# EAGLE schematic SLA_1500_CAM_V3 (EAGLE 9.2.1)
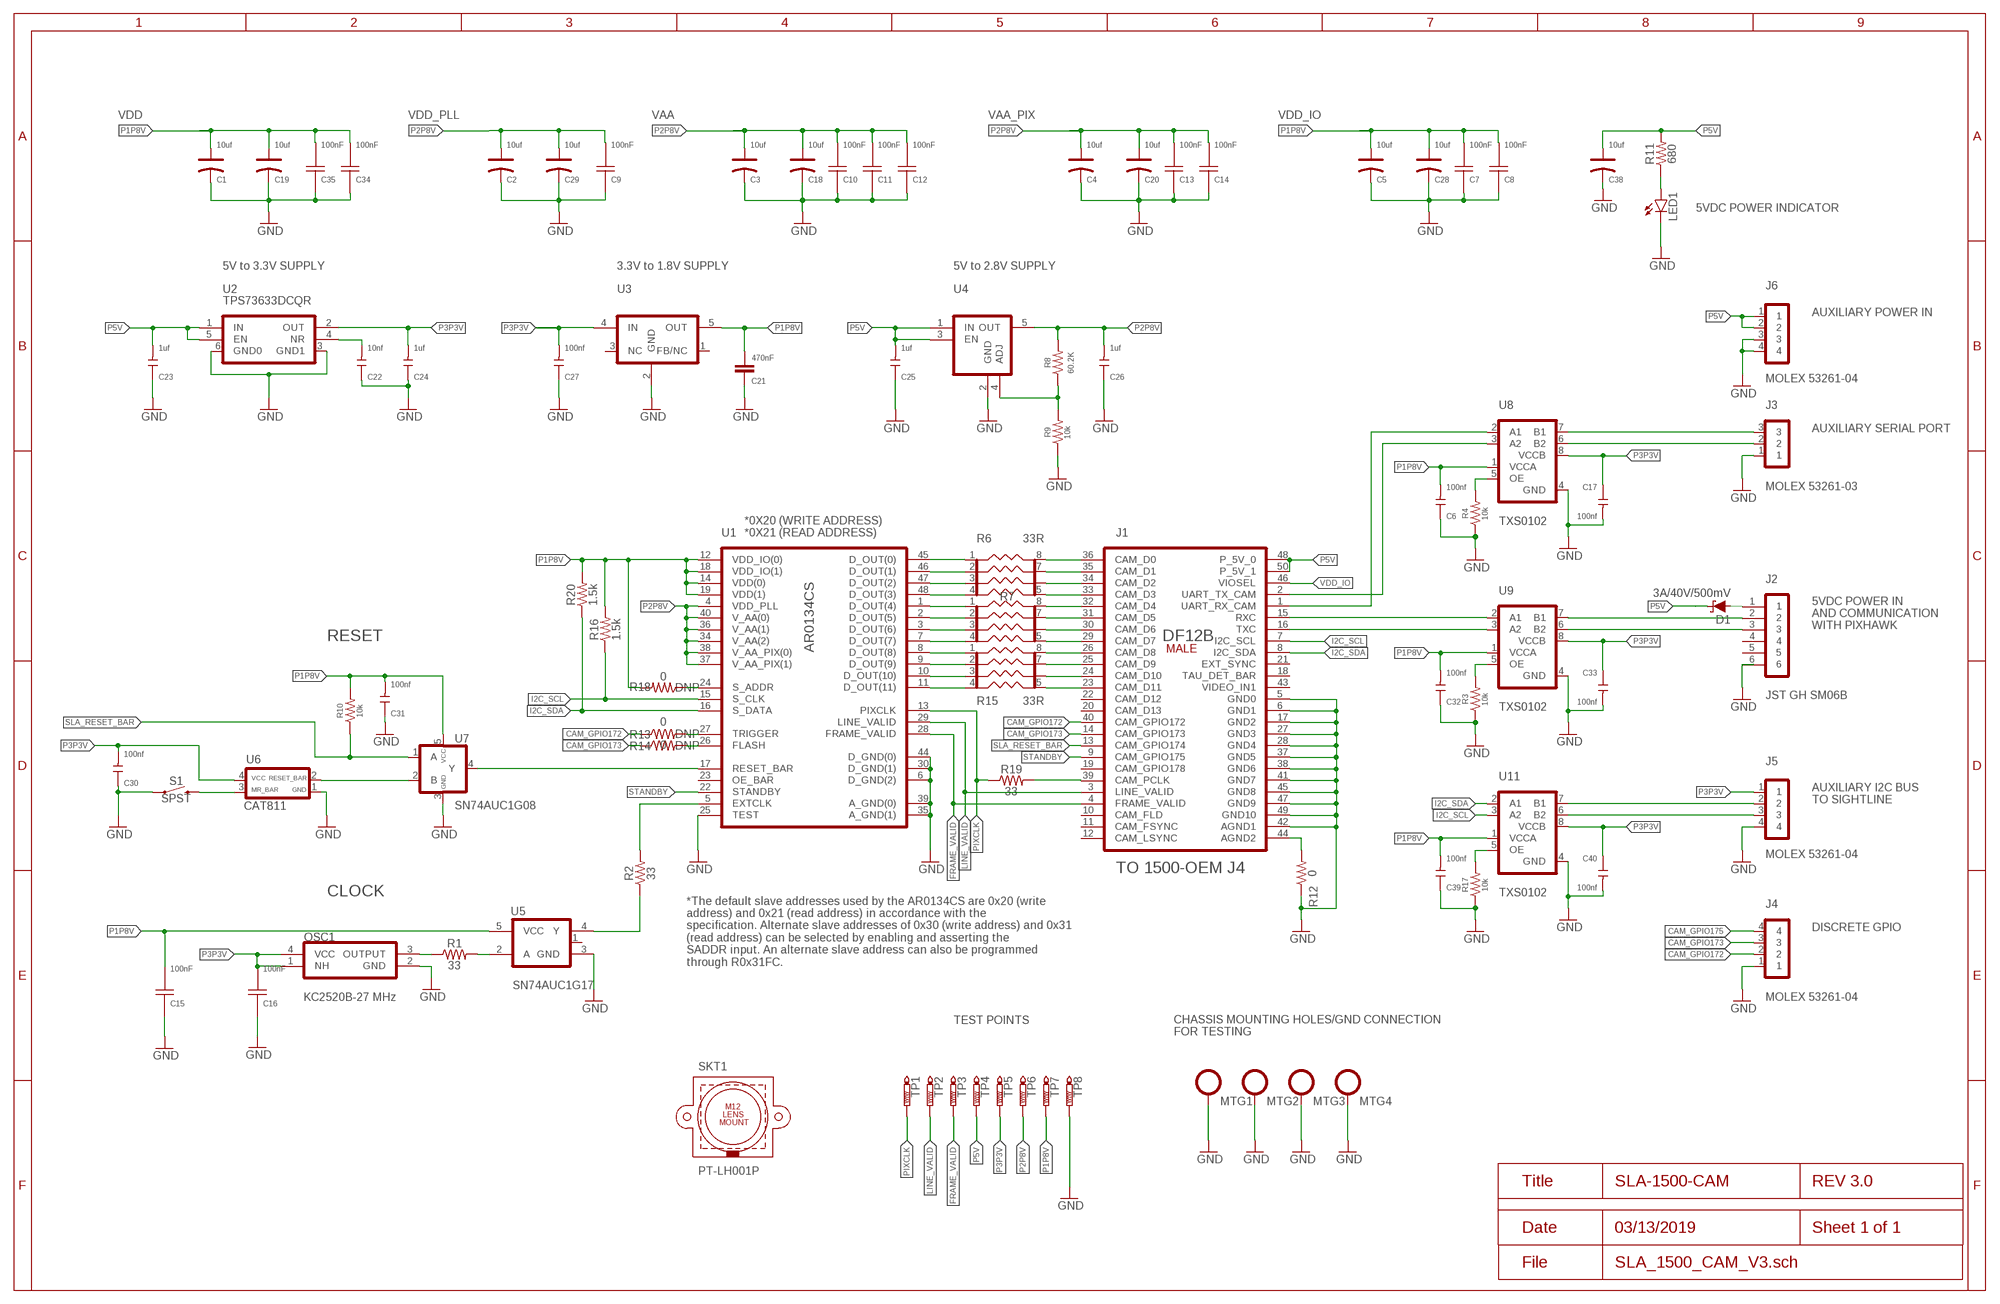
[diagram p0: schematic, sheet 1]
FRAME1 (FRAME_B_L): SPICEPREFIX: X

## Parts
C1  10uf  TANTALUM-SMD-10UF-10V-10%(AVX-A)  [AVX-A]
C2  10uf  TANTALUM-SMD-10UF-10V-10%(AVX-A)  [AVX-A]
C3  10uf  TANTALUM-SMD-10UF-10V-10%(AVX-A)  [AVX-A]
C4  10uf  TANTALUM-SMD-10UF-10V-10%(AVX-A)  [AVX-A]
C5  10uf  TANTALUM-SMD-10UF-10V-10%(AVX-A)  [AVX-A]
C6  100nf  CERAMIC-100NF-25V-10%-X7R(0402)  [C0402]
C7  CAP0201100NF  [R0201]
C8  CAP0201100NF  [R0201]
C9  CAP0201100NF  [R0201]
C10  CAP0201100NF  [R0201]
C11  CAP0201100NF  [R0201]
C12  CAP0201100NF  [R0201]
C13  CAP0201100NF  [R0201]
C14  CAP0201100NF  [R0201]
C15  CAP0201100NF  [R0201]
C16  CAP0201100NF  [R0201]
C17  100nf  CERAMIC-100NF-25V-10%-X7R(0402)  [C0402]
C18  10uf  TANTALUM-SMD-10UF-10V-10%(AVX-A)  [AVX-A]
C19  10uf  TANTALUM-SMD-10UF-10V-10%(AVX-A)  [AVX-A]
C20  10uf  TANTALUM-SMD-10UF-10V-10%(AVX-A)  [AVX-A]
C21  470nF  470NF-0402-16V-10%  [0402]
C22  10nf  CERAMIC-10NF-50V-10%-X7R(0402)  [C0402]
C23  1uf  CERAMIC-1UF-10V-10%-X5R(0402)  [C0402]
C24  1uf  CERAMIC-1UF-10V-10%-X5R(0402)  [C0402]
C25  1uf  CERAMIC-1UF-10V-10%-X5R(0402)  [C0402]
C26  1uf  CERAMIC-1UF-10V-10%-X5R(0402)  [C0402]
C27  100nf  CERAMIC-100NF-25V-10%-X7R(0402)  [C0402]
C28  10uf  TANTALUM-SMD-10UF-10V-10%(AVX-A)  [AVX-A]
C29  10uf  TANTALUM-SMD-10UF-10V-10%(AVX-A)  [AVX-A]
C30  100nf  CERAMIC-100NF-25V-10%-X7R(0402)  [C0402]
C31  100nf  CERAMIC-100NF-25V-10%-X7R(0402)  [C0402]
C32  100nf  CERAMIC-100NF-25V-10%-X7R(0402)  [C0402]
C33  100nf  CERAMIC-100NF-25V-10%-X7R(0402)  [C0402]
C34  CAP0201100NF  [R0201]
C35  CAP0201100NF  [R0201]
C38  10uf  TANTALUM-SMD-10UF-10V-10%(AVX-A)  [AVX-A]
C39  100nf  CERAMIC-100NF-25V-10%-X7R(0402)  [C0402]
C40  100nf  CERAMIC-100NF-25V-10%-X7R(0402)  [C0402]
D1  3A/40V/500mV  DIODE-SCHOTTKY-B340A  [SMA-DIODE]
J1  DF12B(5.0)-50DS-0.5(86)SMT  [DF12B(5.0)-50DS-0.5V(86)]
J2  JST GH SM06B  JST_GH_SM06B-GHS-TB  [JST_SM06B-GHS-TB]
J3  MOLEX 53261-03  MOLEX53261-03  [53261-03]
J4  MOLEX 53261-04  MOLEX53261-04  [53261-04]
J5  MOLEX 53261-04  MOLEX53261-04  [53261-04]
J6  MOLEX 53261-04  MOLEX53261-04  [53261-04]
LED1  LEDCHIP-LED0603  [CHIP-LED0603]
MTG1  SLA_MOUNTING  [SLA_MOUNTING]
MTG2  SLA_MOUNTING  [SLA_MOUNTING]
MTG3  SLA_MOUNTING  [SLA_MOUNTING]
MTG4  SLA_MOUNTING  [SLA_MOUNTING]
OSC1  KC2520B-27MHZ  [2.5X2.0_SMDCRYSTAL]
R1  33  RESISTOR0402  [0402]
R2  33  RESISTOR0402  [0402]
R3  10k  10KOHM-0603-1/10W-1%  [0603]
R4  10k  10KOHM-0603-1/10W-1%  [0603]
R6  33R  YC124-JR-0733RL  [DILR-4]
R7  YC124-JR-0733RL  [DILR-4]
R8  60.2K  62KOHM-0603-1/10W-5%  [0603]
R9  10k  10KOHM-0603-1/10W-1%  [0603]
R10  10k  10KOHM-0603-1/10W-1%  [0603]
R11  680  680OHM-0603-1/10W-5%  [0603]
R12  0  RESISTOR0402  [0402]
R13  0  RESISTOR0402  [0402]
R14  0  RESISTOR0402  [0402]
R15  33R  YC124-JR-0733RL  [DILR-4]
R16  1.5k  1.5KOHM-0603-1/10W-1%  [0603]
R17  10k  10KOHM-0603-1/10W-1%  [0603]
R18  0  RESISTOR0402  [0402]
R19  33  RESISTOR0402  [0402]
R20  1.5k  1.5KOHM-0603-1/10W-1%  [0603]
S1  SPST  MOMENTARY-SWITCH-SPST-SMD-4.6X2.8MM  [TACTILE_SWITCH_SMD_4.6X2.8MM]
SKT1  PT-LH001P  M12_LENS_MOUNT  [M12_HOLDER]
TP1  PTR1PAD1-13  [P1-13]
TP2  PTR1PAD1-13  [P1-13]
TP3  PTR1PAD1-13  [P1-13]
TP4  PTR1PAD1-13  [P1-13]
TP5  PTR1PAD1-13  [P1-13]
TP6  PTR1PAD1-13  [P1-13]
TP7  PTR1PAD1-13  [P1-13]
TP8  PTR1PAD1-13  [P1-13]
U1  AR0134CS-ILCC48  [ILCC48]
U2  TPS73633DCQR  [SOT-223-6-PIN]
U3  TPS71518DCKR  [TI-SC70-5]
U4  AP7331-WG-7  [SOT-25]
U5  SN74AUC1G17  [SOT23-5]
U6  CAT811  [SOT-143-4]
U7  SN74AUC1G08  [SOT23-5]
U8  TXS0102  TXS0102DQM  [X2SON(8)1.8X1.2MM]
U9  TXS0102  TXS0102DQM  [X2SON(8)1.8X1.2MM]
U11  TXS0102  TXS0102DQM  [X2SON(8)1.8X1.2MM]

## Nets
CAM_GPIO172: J1.40(CAM_GPIO172) J4.2 R13.1
CAM_GPIO173: J1.14(CAM_GPIO173) J4.3 R14.1
CAM_GPIO175: J4.4
FRAME_VALID: J1.4(FRAME_VALID) TP3.TP U1.28(FRAME_VALID)
GND: C1.- C2.- C3.- C4.- C5.- C6.1 C7.2 C8.2 C9.2 C10.2 C11.2 C12.2 C13.2 C14.2 C15.2 C16.2 C17.2 C18.- C19.- C20.- C21.2 C22.1 C23.1 C24.1 C25.1 C26.1 C27.1 C28.- C29.- C30.1 C31.1 C32.1 C33.2 C34.2 C35.2 C38.- C39.1 C40.2 J1.5(GND0) J1.6(GND1) J1.17(GND2) J1.27(GND3) J1.28(GND4) J1.37(GND5) J1.38(GND6) J1.41(GND7) J1.42(AGND1) J1.45(GND8) J1.47(GND9) J1.49(GND10) J2.6 J3.1 J4.1 J5.4 J6.3 J6.4 LED1.C MTG1.P$1 MTG2.P$1 MTG3.P$1 MTG4.P$1 OSC1.2(GND) R3.1 R4.1 R9.1 R12.1 R17.1 S1.1 S1.2 TP8.TP U1.6(D_GND(2)) U1.25(TEST) U1.30(D_GND(1)) U1.35(A_GND(1)) U1.39(A_GND(0)) U1.44(D_GND(0)) U2.3(GND1) U2.6(GND0) U3.2(GND) U4.2(GND) U5.3(GND) U6.1(GND) U7.3(GND) U8.4(GND) U9.4(GND) U11.4(GND)
I2C_SCL: J1.7(I2C_SCL) R16.1 U1.15(S_CLK) U11.3(A2)
I2C_SDA: J1.8(I2C_SDA) R20.1 U1.16(S_DATA) U11.2(A1)
LINE_VALID: J1.3(LINE_VALID) TP2.TP U1.29(LINE_VALID)
N$1: J2.3 U9.6(B2)
N$2: R3.2 U9.5(OE)
N$3: R4.2 U8.5(OE)
N$4: R6.1 U1.45(D_OUT(0))
N$5: J1.36(CAM_D0) R6.8
N$6: R6.2 U1.46(D_OUT(1))
N$7: J1.35(CAM_D1) R6.7
N$8: R6.3 U1.47(D_OUT(2))
N$9: J1.34(CAM_D2) R6.6
N$10: R6.4 U1.48(D_OUT(3))
N$11: J1.33(CAM_D3) R6.5
N$12: R7.1 U1.1(D_OUT(4))
N$13: J3.3 U8.7(B1)
N$14: J1.32(CAM_D4) R7.8
N$15: R1.2 U5.2(A)
N$16: OSC1.3(OUTPUT) R1.1
N$17: J2.2 U9.7(B1)
N$18: J3.2 U8.6(B2)
N$19: J1.1(UART_RX_CAM) U8.2(A1)
N$20: J1.2(UART_TX_CAM) U8.3(A2)
N$21: C22.2 U2.4(NR)
N$22: R7.2 U1.2(D_OUT(5))
N$23: R8.1 R9.2 U4.4(ADJ)
N$24: J1.31(CAM_D5) R7.7
N$25: R2.1 U5.4(Y)
N$26: R2.2 U1.5(EXTCLK)
N$27: S1.3 S1.4 U6.3(MR_BAR)
N$28: U6.2(RESET_BAR) U7.2(B)
N$29: U1.17(RESET_BAR) U7.4(Y)
N$30: LED1.A R11.1
N$31: J1.44(AGND2) R12.2
N$32: R13.2 U1.27(TRIGGER)
N$33: R14.2 U1.26(FLASH)
N$34: D1.A J2.1
N$35: J1.15(RXC) U9.2(A1)
N$36: J1.16(TXC) U9.3(A2)
N$37: J5.2 U11.7(B1)
N$38: J5.3 U11.6(B2)
N$40: R7.3 U1.3(D_OUT(6))
N$41: J1.30(CAM_D6) R7.6
N$42: R7.4 U1.7(D_OUT(7))
N$43: J1.29(CAM_D7) R7.5
N$44: R15.1 U1.8(D_OUT(8))
N$45: J1.26(CAM_D8) R15.8
N$46: R15.2 U1.9(D_OUT(9))
N$47: J1.25(CAM_D9) R15.7
N$48: R15.3 U1.10(D_OUT(10))
N$49: J1.24(CAM_D10) R15.6
N$50: R15.4 U1.11(D_OUT(11))
N$51: J1.23(CAM_D11) R15.5
N$52: R18.1 U1.24(S_ADDR)
N$53: J1.39(CAM_PCLK) R19.2
N$54: R17.2 U11.5(OE)
P1P8V: C1.+ C5.+ C6.2 C7.1 C8.1 C15.1 C19.+ C21.1 C28.+ C31.2 C32.2 C34.1 C35.1 C39.2 R10.2 R16.2 R18.2 R20.2 TP7.TP U1.12(VDD_IO(0)) U1.14(VDD(0)) U1.18(VDD_IO(1)) U1.19(VDD(1)) U3.5(OUT) U5.5(VCC) U7.5(VCC) U8.1(VCCA) U9.1(VCCA) U11.1(VCCA)
P2P8V: C2.+ C3.+ C4.+ C9.1 C10.1 C11.1 C12.1 C13.1 C14.1 C18.+ C20.+ C26.2 C29.+ R8.2 TP6.TP U1.4(VDD_PLL) U1.34(V_AA(2)) U1.36(V_AA(1)) U1.37(V_AA_PIX(1)) U1.38(V_AA_PIX(0)) U1.40(V_AA(0)) U4.5(OUT)
P3P3V: C16.1 C17.1 C24.2 C27.2 C30.2 C33.1 C40.1 J5.1 OSC1.1(NH) OSC1.4(VCC) TP5.TP U2.2(OUT) U3.4(IN) U6.4(VCC) U8.8(VCCB) U9.8(VCCB) U11.8(VCCB)
P5V: C23.2 C25.2 C38.+ D1.C J1.48(P_5V_0) J1.50(P_5V_1) J6.1 J6.2 R11.2 TP4.TP U2.1(IN) U2.5(EN) U4.1(IN) U4.3(EN)
PIXCLK: R19.1 TP1.TP U1.13(PIXCLK)
SLA_RESET_BAR: J1.13(CAM_GPIO174) R10.1 U7.1(A)
STANDBY: J1.9(CAM_GPIO175) U1.22(STANDBY)
VDD_IO: J1.46(VIOSEL)
Unconnected: J1.10(CAM_FLD) J1.11(CAM_FSYNC) J1.12(CAM_LSYNC) J1.18(TAU_DET_BAR) J1.19(CAM_GPIO178) J1.20(CAM_D13) J1.21(EXT_SYNC) J1.22(CAM_D12) J1.43(VIDEO_IN1) J2.4 J2.5 U1.23(OE_BAR) U3.1(FB/NC) U3.3(NC) U5.1(NC)

## Notes on the sheet
- VDD | VDD_PLL | VAA | VAA_PIX | VDD_IO
- 5VDC POWER INDICATOR
- 5V to 3.3V SUPPLY | 3.3V to 1.8V SUPPLY | 5V to 2.8V SUPPLY
- AUXILIARY POWER IN
- AUXILIARY SERIAL PORT
- *0X20 (WRITE ADDRESS)
  *0X21 (READ ADDRESS)
- 5VDC POWER IN 
  AND COMMUNICATION 
  WITH PIXHAWK
- RESET
- DNP
- DNP
- DNP
- AUXILIARY I2C BUS 
  TO SIGHTLINE
- TO 1500-OEM J4
- CLOCK
- DISCRETE GPIO
- *The default slave addresses used by the AR0134CS are 0x20 (write
  address) and 0x21 (read address) in accordance with the
  specification. Alternate slave addresses of 0x30 (write address) and 0x31 
  (read address) can be selected by enabling and asserting the
  SADDR input. An alternate slave address can also be programmed
  through R0x31FC.
- TEST POINTS
- CHASSIS MOUNTING HOLES/GND CONNECTION
  FOR TESTING

## Library data of the parts
C1-C5 C18-C20 C28 C29 C38 = Seeed-Capacitor:TANTALUM-SMD-10UF-10V-10%(AVX-A): 302020011; MPN: TAJA106K010RNJ
C6 C17 C27 C30-C33 C39 C40 = Seeed-Capacitor:CERAMIC-100NF-25V-10%-X7R(0402): 302010024; MPN: CC0402KRX7R8BB104
C7-C16 C34 C35 = Sightline:CAP0201: CAP0201 PANASONIC CERAMIC CAPACITOR CAP, CERAMIC, 100nF, 10V, X5R, 20%, 0201; DESCRIPTION: CAP, CERAMIC, 100nF, 10V, X5R, 20%, 0201; MANF: PANASONIC; MANF#: ECJZEB1A104M
C21 = SparkFun-Capacitors:470NF: 0.47uF/470nF ceramic capacitors A capacitor is a passive two-terminal electrical component used to store electrical energy temporarily in an electric field.; PROD_ID: CAP-09041
C22 = Seeed-Capacitor:CERAMIC-10NF-50V-10%-X7R(0402): 302010006; MPN: CC0402KRX7R9BB103
C23-C26 = Seeed-Capacitor:CERAMIC-1UF-10V-10%-X5R(0402): 302010040; MPN: CC0402KRX5R6BB105
D1 = SparkFun-DiscreteSemi:DIODE-SCHOTTKY: Schottky diode A Schottky diode is a semiconductor diode which has a low forward voltage drop and a very fast switching action.; PROD_ID: DIO-09886
J1 = Sightline:DF12B(5.0)-50DS-0.5(86): DF12B(5.0)-50DS-0.5(86) DF12 Series 0.5 mm Pitch SMT Board-to-Board Connector (MALE) Specifications Manufacturer: Hirose Manufacturer Part Number: 537-0309-6 86 Operating Temperature Range(C): -45 - 125 Current Rating: 0.3A Voltage Rating: 50V AC Body Size(mm): 14.6 x 3.6 DF12B(5.0)-50DS DATASHEET <https://www.hirose.com/product/en/products/DF12/> Created by: Kimball S. Davis kimball4@pdx.edu <mailto: kimball4@pdx.edu> 21 January 2019 Version 001; DESCRIPTION: DF12B-50DS-0.5V(86) Hirose Male 50-pin connector; MANF: Hirose; MANF#: 537-0309-6 86
J2 = Sightline:JST_GH_SM06B-GHS-TB: JST SM06B-GHS-TB JST Type GH 1.25mm side-entry smt 6-pin connector Specifications Manufacturer: JST Manufacturer Part Number: SM06B-GHS-TB Body Size(mm): 10.75 X 4.25 JST TYPE GH DATASHEET <http://www.jst-mfg.com/product/pdf/eng/eGH.pdf> Created by: Kimball S. Davis 5 February 2019 Version 001; DESCRIPTION: 1.25 MM SIDE-ENTRY 6-PIN SMT CONNECTOR; MANF: JST; MANF#: SM06B-GHS-TB
J3 = Sightline:MOLEX53261-03: MOLEX 53261-03 1.25mm Pitch PicoBlade Header, Surface Mount, Right-Angle, 3 Circuits, Tin (Sn) Plating 53261-03 DATASHEET <https://www.molex.com/webdocs/datasheets/pdf/en-us/0532610371_PCB_HEADERS.pdf>; DESCRIPTION: 1.25mm Pitch PicoBlade Header, Surface Mount, Right-Angle, 3 Circuits, Tin (Sn) Plating; MANF: MOLEX; MANF#: 532610371
J4-J6 = Sightline:MOLEX53261-04: MOLEX 53261-04 1.25mm Pitch PicoBlade Header, Surface Mount, Right-Angle, 4 Circuits, Tin (Sn) Plating 53261-04 DATASHEET <https://www.molex.com/webdocs/datasheets/pdf/en-us/0532610471_PCB_HEADERS.pdf>; DESCRIPTION: 1.25mm Pitch PicoBlade Header, Surface Mount, Right-Angle, 4 Circuits, Tin (Sn) Plating; MANF: MOLEX; MANF#: 532610471
LED1 = led:LED: LED OSRAM: - CHIPLED LG R971, LG N971, LY N971, LG Q971, LY Q971, LO R971, LY R971 LH N974, LH R974 LS Q976, LO Q976, LY Q976 LO Q996 - Hyper CHIPLED LW Q18S LB Q993, LB Q99A, LB R99A - SideLED LS A670, LO A670, LY A670, LG A670, LP A670 LB A673, LV A673, LT A673, LW A673 LH A674 LY A675 LS A676, LA A676, LO A676, LY A676, LW A676 LS A679, LY A679, LG A679 - Hyper Micro SIDELED® LS Y876, LA Y876, LO Y876, LY Y876 LT Y87S - SmartLED LW L88C, LW L88S LB L89C, LB L89S, LG L890 LS L89K, LO L89K, LY L89K LS L896, LA L896, LO L896, LY L896 - TOPLED LS T670, LO T670, LY T670, LG T670, LP T670 LSG T670, LSP T670, LSY T670, LOP T670, LYG T670 LG T671, LOG T671, LSG T671 LB T673, LV T673, LT T673, LW T673 LH T674 LS T676, LA T676, LO T676, LY T676, LB T676, LH T676, LSB T676, LW T676 LB T67C, LV T67C, LT T67C, LS T67K, LO T67K, LY T67K, LW E67C LS E67B, LA E67B, LO E67B, LY E67B, LB E67C, LV E67C, LT E67C LW T67C LS T679, LY T679, LG T679 LS T770, LO T770, LY T770, LG T770, LP T770 LB T773, LV T773, LT T773, LW T773 LH T774 LS E675, LA E675, LY E675, LS T675 LS T776, LA T776, LO T776, LY T776, LB T776 LHGB T686 LT T68C, LB T68C - Hyper Mini TOPLED® LB M676 - Mini TOPLED Santana® LG M470 LS M47K, LO M47K, LY M47K Source: http://www.osram.convergy.de LUXEON: - LUMILED® LXK2-PW12-R00, LXK2-PW12-S00, LXK2-PW14-U00, LXK2-PW14-V00 LXK2-PM12-R00, LXK2-PM12-S00, LXK2-PM14-U00 LXK2-PE12-Q00, LXK2-PE12-R00, LXK2-PE12-S00, LXK2-PE14-T00, LXK2-PE14-U00 LXK2-PB12-K00, LXK2-PB12-L00, LXK2-PB12-M00, LXK2-PB14-N00, LXK2-PB14-P00, LXK2-PB14-Q00 LXK2-PR12-L00, LXK2-PR12-M00, LXK2-PR14-Q00, LXK2-PR14-R00 LXK2-PD12-Q00, LXK2-PD12-R00, LXK2-PD12-S00 LXK2-PH12-R00, LXK2-PH12-S00 LXK2-PL12-P00, LXK2-PL12-Q00, LXK2-PL12-R00 Source: www.luxeon.com KINGBRIGHT: KA-3528ASYC Source: www.kingbright.com
MTG1-MTG4 = Sightline:SLA_MOUNTING
OSC1 = Sightline:KC2520B-27MHZ: KC2520B-27MHz-2.5X2.0 27 MHz SMT Clock Oscillator with CMOS output Specifications Manufacturer: Kyocera Manufacturer Part Number: KC2520B27.0000C2GE00 Supply Voltage: 1.8 to 3.3V Body Size(mm): 2.5 x 2.0 KC2520B DATASHEET <https://www.mouser.com/datasheet/2/909/kc2520b_c1_e-1388834.pdf> Created by: Kimball S. Davis 25 January 2019 Version 001; DESCRIPTION: OSC, CRYSTAL CLOCK, SMD, CMOS, 2.25V TO 3.63V, 4mA, 27.0000MHz, 2.5MM x 2.0MM; MANF: Kyocera; MANF#: KC2520B27.0000C2GE00
R1 R2 R12-R14 R18 R19 = SparkFun-Resistors:RESISTOR: Generic Resistor Package
R3 R4 R9 R10 R17 = SparkFun-Resistors:10KOHM: 10kΩ resistor A resistor is a passive two-terminal electrical component that implements electrical resistance as a circuit element. Resistors act to reduce current flow, and, at the same time, act to lower voltage levels within circuits. - Wikipedia; PROD_ID: RES-00824
R6 R7 R15 = Sightline:YC124-JR-0733RL: YC124J-33CT-ND RES ARRAY 4 RES 33 OHM 0804 YC124J DATASHEET <https://media.digikey.com/pdf/Data%20Sheets/Yageo%20PDFs/YC102-358,TC122-164_Series_DS.pdf>; DESCRIPTION: Resistor Array 4 Resistors 33 ohm 5% 0804; MANF: YAGEO; MANF#: YC124-JR-0733RL
R8 = SparkFun-Resistors:62KOHM: 62kΩ resistor A resistor is a passive two-terminal electrical component that implements electrical resistance as a circuit element. Resistors act to reduce current flow, and, at the same time, act to lower voltage levels within circuits. - Wikipedia
R11 = SparkFun-Resistors:680OHM: 680Ω resistor A resistor is a passive two-terminal electrical component that implements electrical resistance as a circuit element. Resistors act to reduce current flow, and, at the same time, act to lower voltage levels within circuits. - Wikipedia; PROD_ID: RES-09333
R16 R20 = SparkFun-Resistors:1.5KOHM: 1.5kΩ resistor A resistor is a passive two-terminal electrical component that implements electrical resistance as a circuit element. Resistors act to reduce current flow, and, at the same time, act to lower voltage levels within circuits. - Wikipedia; PROD_ID: RES-08306
S1 = SparkFun-Switches:MOMENTARY-SWITCH-SPST: Momentary Switch (Pushbutton) - SPST Normally-open (NO) SPST momentary switches (buttons, pushbuttons). Variants PTH-12MM - 12mm square, through-hole Momentary Pushbutton Switch - 12mm Square <https://www.sparkfun.com/products/9190> (COM-09190) PTH-6.0MM, PTH-6.0MM-KIT - 6.0mm square, through-hole Mini Pushbutton Switch <https://www.sparkfun.com/products/97> (COM-00097) KIT package intended for soldering kit's - only one side of pads' copper is exposed. PTH-RIGHT-ANGLE-KIT - Right-angle, through-hole Right Angle Tactile Button <https://www.sparkfun.com/products/10791> - Used on SparkFun BigTime Watch Kit <https://www.sparkfun.com/products/11734> SMD-12MM - 12mm square, surface-mount Tactile Button - SMD (12mm) <https://www.sparkfun.com/products/12993> (COM-12993) Used on SparkFun PicoBoard <https://www.sparkfun.com/products/11888> SMD-4.5MM - 4.5mm Square Trackball Switch Used on SparkFun Blackberry Trackballer Breakout <https://www.sparkfun.com/products/13169> SMD-4.6MMX2.8MM - 4.60mm x 2.80mm, surface mount Used on SparkFun SAMD21 Mini Breakout <https://www.sparkfun.com/products/13664> SMD-5.2MM, SMD-5.2-REDUNDANT - 5.2mm square, surface-mount Mini Pushbutton Switch - SMD <https://www.sparkfun.com/products/8720> (COM-08720) Used on Arduino Pro Mini <https://www.sparkfun.com/products/11114> REDUNDANT package connects both switch circuits together SMD-6.0X3.5MM - 6.0 x 3.5mm, surface mount Momentary Reset Switch SMD <https://www.sparkfun.com/products/8229> (COM-08229) SMD-6.2MM-TALL - 6.2mm square, surface mount Tactile Button - SMD (6mm) <https://www.sparkfun.com/products/12992> Used on SparkFun Digital Sandbox <https://www.sparkfun.com/products/12651> SMD-RIGHT-ANGLE - Right-angle, surface mount Used on SparkFun Block for Intel® Edison - Arduino <https://www.sparkfun.com/products/13036>; PROD_ID: SWCH-13065
SKT1 = Sightline:M12_LENS_MOUNT: PT-LH001P PT-LH001P Plastic M12 Lens Holder, 20mm Hole Spacing; DESCRIPTION: PT-LH001P Plastic M12 Lens Holder, 20mm Hole Spacing; MANF: M12 LENSES; MANF#: PT-LH001P
TP1-TP8 = testpad:PTR1: TEST PIN
U1 = Sightline:AR0134CS-ILCC48: AR0134CS-1LCC48-10x10 1/3-inch 1.2 Mp CMOS digital image sensor with an active-pixel array of 1280 (H) × 960 (V) Specifications Manufacturer: On Semiconductor Manufacturer Part Number: AR0134CSSM00SPCA0 Operating Temperature Range(C): -30 - 70 Supply Voltage: I/O: 1.8 or 2.8V Digital: 1.8V Analog: 2.8V HiSPi: 0.4V Body Size(mm): 10 x 10 ARO134CS DATASHEET <https://www.onsemi.com/pub/Collateral/AR0134CS-D.PDF> Created by: Kimball S. Davis kimball4@pdx.edu <mailto: kimball4@pdx.edu> 22 January 2019 Version 001; DESCRIPTION: 1/3-inch 1.2 Mp CMOS digital image sensor with an active-pixel array of 1280 (H) × 960 (V); MANF: On Semiconductor; MANF#: AR0134CSSM00SPCA0
U2 = Sightline:TPS73633DCQR: TPS73633DCQR Cap-Free, NMOS, 400-mA Low-Dropout Regulator with Reverse Current Protection 5.5 to 3.3V, SOT-223 6-pin, 6.5 x 3.5 mm TPS73633DCQR DATASHEET <http://www.ti.com/lit/ds/symlink/tps736.pdf>; DESCRIPTION: Cap-Free, NMOS, 400-mA Low-Dropout Regulator with Reverse Current Protection 5.5 to 3.3V, SOT-223 6-pin, 6.5 x 3.5 mm; MANF: TEXAS INSTRUMENTS; MANF#: TPS73633DCQR
U3 = Sightline:TPS71518DCKR: TPS71518DCKR 50-mA, 24-V, 3.2-μA Supply Current Low-Dropout Linear Regulator in SC70 5-Pin Package, 3.3 to 1.8V, 2.15 x 1.4mm TPS71518DCKR DATASHEET <http://www.ti.com/lit/ds/symlink/tps715.pdf>; DESCRIPTION: 50-mA, 24-V, 3.2-μA Supply Current Low-Dropout Linear Regulator in SC70 5-Pin Package, 3.3 to 1.8V, 2.15 x 1.4mm; MANF: TEXAS INSTRUMENTS; MANF#: TPS71518DCKR
U4 = Sightline:AP7331-WG-7: AP7331-WG-7 300mA, LOW QUIESCENT CURRENT, FAST TRANSIENT LOW DROPOUT LINEAR REGULATOR, ADJUSTABLE OUTPUT, 5V to 2.8V, 3.1 x 1.7mm AP7331 DATASHEET <https://www.diodes.com/assets/Datasheets/AP7331.pdf>; DESCRIPTION: 300mA, LOW QUIESCENT CURRENT, FAST TRANSIENT LOW DROPOUT LINEAR REGULATOR, ADJUSTABLE OUTPUT, 5V to 2.8V, 3.1 x 1.7mm; MANF: DIODES INCORPORATED; MANF#: AP7331-WG-7
U5 = Sightline:SN74AUC1G17: SN74AUC1G17-SOT23-5 IC, BUFFER, SINGLE SCHMITT-TRIGGER, 9mA, 0.8V TO 2.7V, SOT23-5 Specifications Manufacturer: Texas Instruments Manufacturer Part Number: SN74AUC1G17DBVR Supply Voltage: 3.6V Max Body Size(mm): 2.9 x 1.6 SN74AUC1G17 DATASHEET <http://www.ti.com/lit/ds/symlink/sn74auc1g17.pdf> Created by: Kimball S. Davis 24 January 2019 Version 001; DESCRIPTION: IC, BUFFER, SINGLE SCHMITT-TRIGGER, 9mA, 0.8V TO 2.7V, SOT23-5; MANF: TEXAS INSTRUMENTS; MANF#: SN74AUC1G17DBV
U6 = Sightline:CAT811: CAT811-SOT-143-4 IC, SUPERVISOR, MICROPROCESSOR POWER SUPPLY, 2.93V, ACTIVE LOW RESET, SOT143-4 Specifications Manufacturer: On Semiconductor Manufacturer Part Number: CAT811STBI Body Size(mm): 2.9 x 1.3 CAT811 DATASHEET <https://www.onsemi.com/pub/Collateral/CAT811-D.PDF> Created by: Kimball S. Davis 23 January 2019 Version 001; DESCRIPTION: IC, SUPERVISOR, MICROPROCESSOR POWER SUPPLY, 2.93V, ACTIVE LOW RESET, SOT143-4; MANF: On Semiconductor; MANF#: CAT811STBI
U7 = Sightline:SN74AUC1G08: SN74AUC1G08-SOT23-5 Single 2-Input Positive-AND Gate Specifications Manufacturer: Texas Instruments Manufacturer Part Number: SN74AUC1G08DBVR Supply Voltage: 1.65 - 1.95V Body Size(mm): 2.9 x 1.6 SN74AUC1G08 DATASHEET <http://www.ti.com/lit/ds/symlink/sn74auc1g08.pdf>; DESCRIPTION: IC, AND GATE, SINGLE, 2 INPUT POSITIVE, SGL, SOT23-5; MANF: Texas Instruments; MANF#: SN74AUC1G08DBVR
U8 U9 U11 = Sightline:TXS0102DQM: TXS0102DQM 1.8 X 1.2 mm TXS0102 2-Bit Bidirectional Voltage-Level Translator TXS0102 DATASHEET <http://www.ti.com/lit/ds/symlink/txs0102.pdf>; DESCRIPTION: TXS0102 2-Bit Bidirectional Voltage-Level Translator for Open-Drain and Push-Pull Applications; MANF: Texas Instruments; MANF#: TXS0102DQM